# Altium project 6inch_mipi_V1.0.PrjPcb
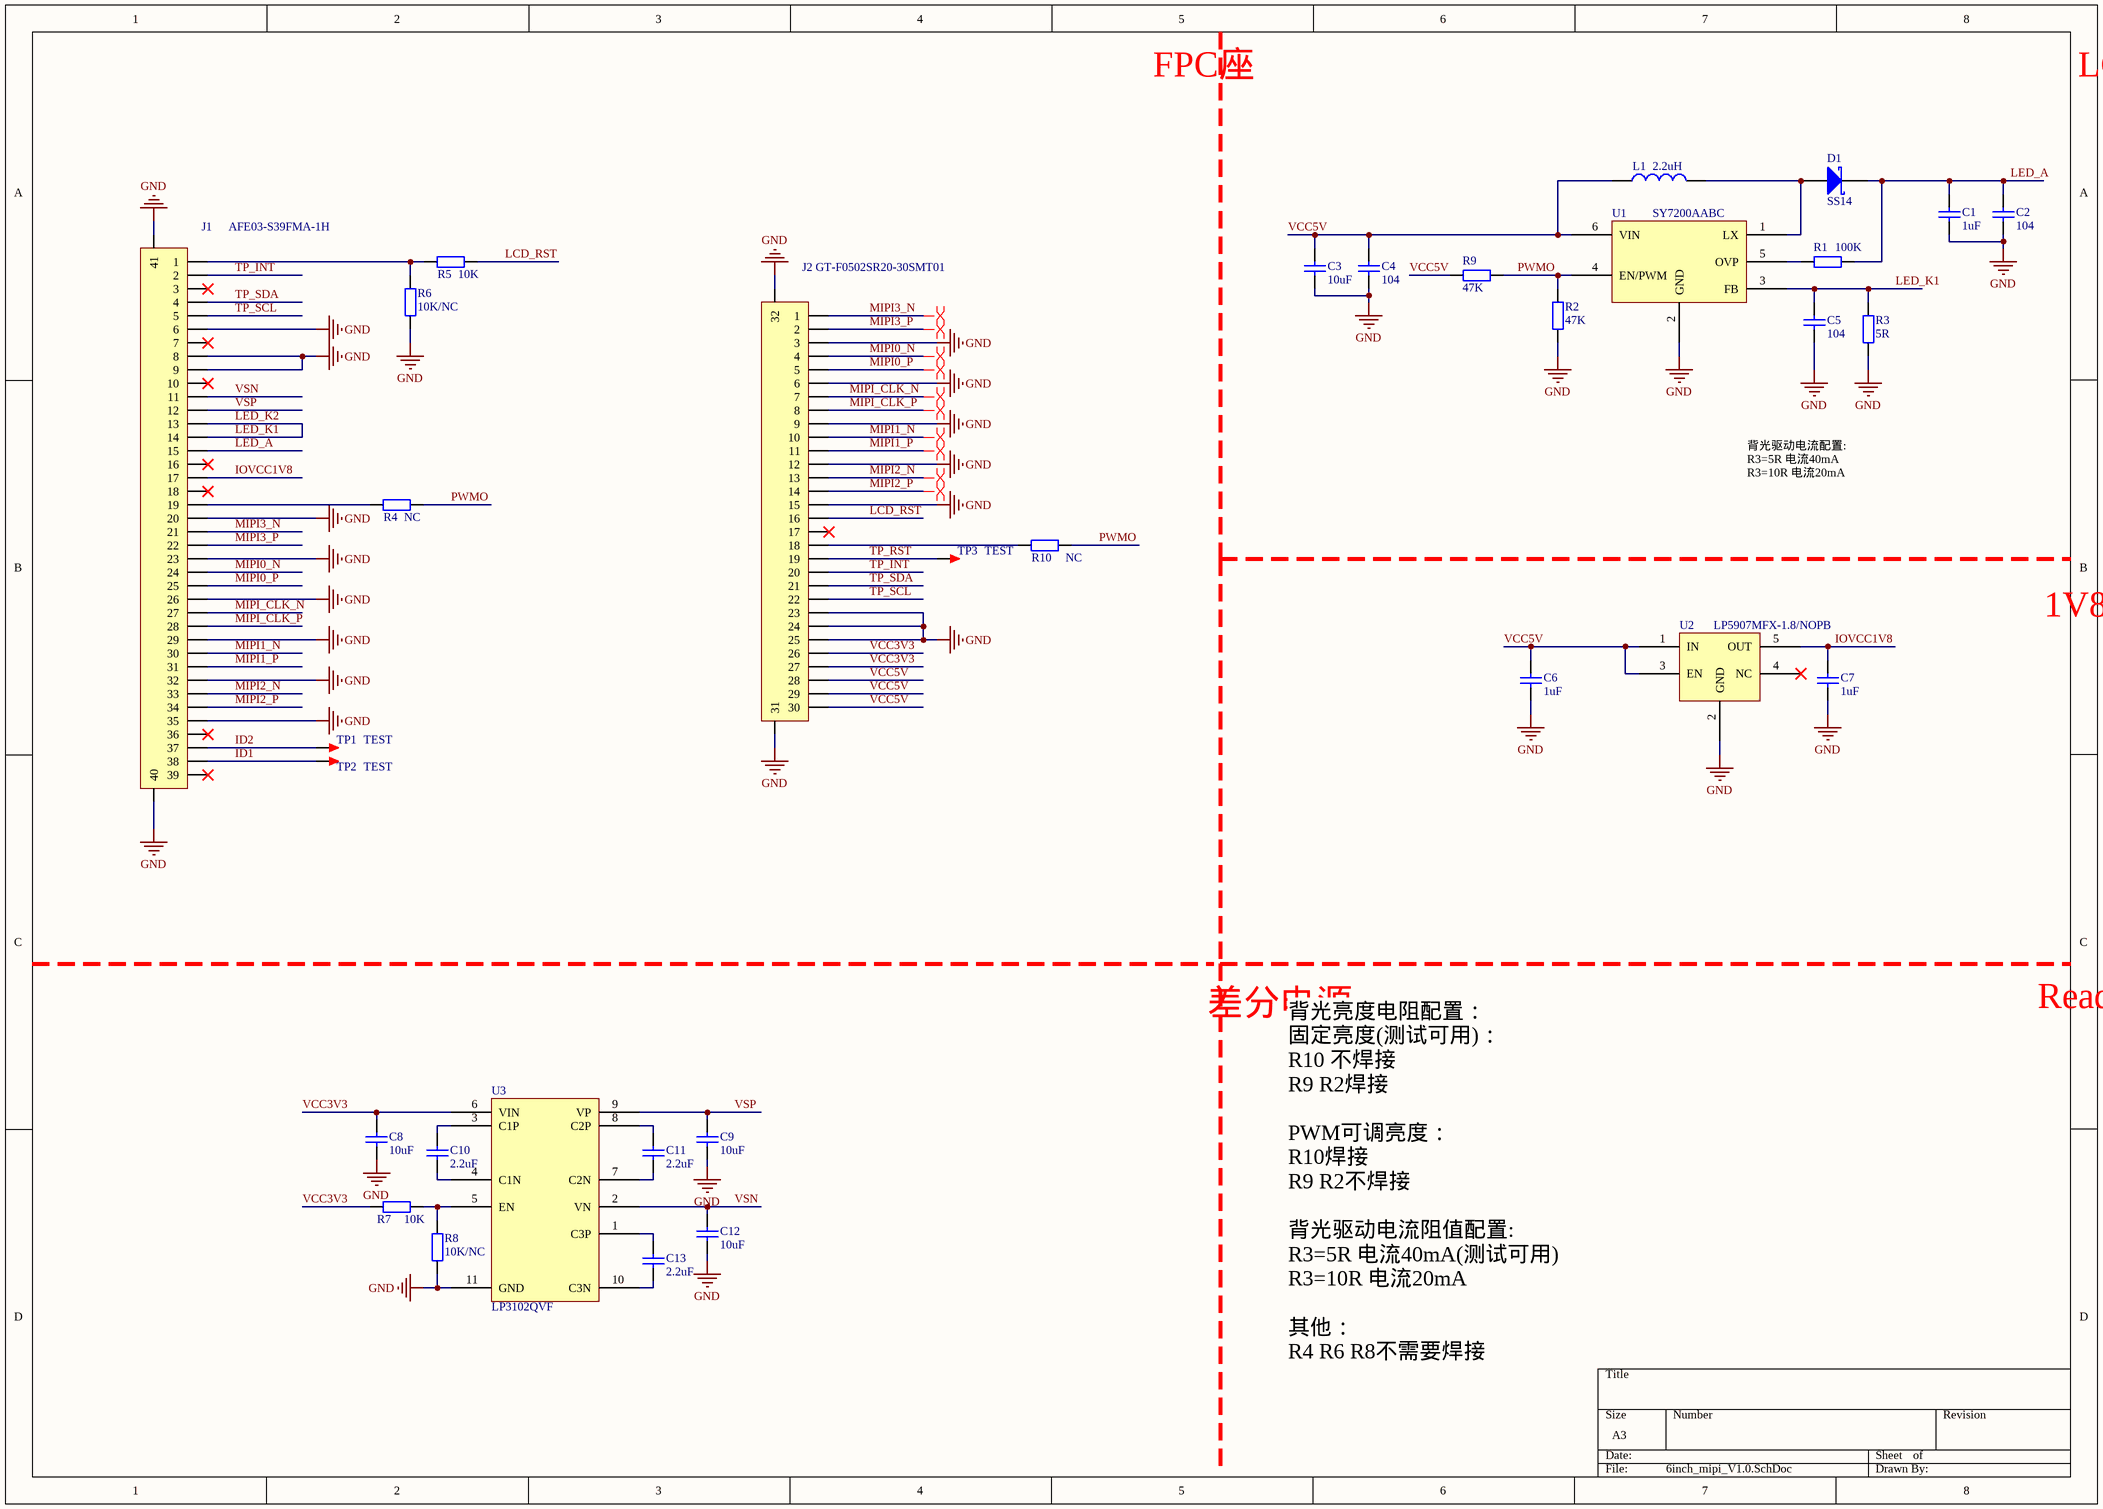
[diagram p0: 6inch_mipi_V1.0.SchDoc]
1 sheet, 33 parts. Net scope: global (net labels, ports and power ports of the same name join across sheets).
Board file: 6inch_mipi_V1.0.PcbDoc

## Sheet 6inch_mipi_V1.0.SchDoc
size A3; SheetNumber: 1; SheetTotal: 1

### Parts
C1  1uF  [C0402_L]
C2  104  [C0402_L]
C3  10uF  [C0402_L]
C4  104  [C0402_L]
C5  104  [C0402_L]
C6  1uF  [C0402_L]
C7  1uF  [C0402_L]
C8  10uF  [C0402_L]
C9  10uF  [C0402_L]
C10  2.2uF  [C0402_L]
C11  2.2uF  [C0402_L]
C12  10uF  [C0402_L]
C13  2.2uF  [C0402_L]
D1  SS14  [SOD-123F]
J1  AFE03-S39FMA-1H  [FPC-SMD_P0.30-39P_FGS-XJ-H1.0]
J2  GT-F0502SR20-30SMT01  [FPC-SMD_30P-P0.50_GT-F0502SR20-30SMT01]
L1  2.2uH  [L-SMD-0420]
R1  100K  [R0402_L]
R2  47K  [R0402_L]
R3  5R  [R0402_L]
R4  NC  [R0402_L]
R5  10K  [R0402_L]
R6  10K/NC  [R0402_L]
R7  10K  [R0402_L]
R8  10K/NC  [R0402_L]
R9  47K  [R0402_L]
R10  NC  [R0402_L]
TP1  TEST  [TEST 1.6]
TP2  TEST  [TEST 1.6]
TP3  TEST  [TEST 1.6]
U1  SY7200AABC  [SOT23-6]
U2  LP5907MFX-1.8/NOPB  [SOT23-5]
U3  LP3102QVF  [TDFN-10_L3.0-W3.0-P0.50-BL-EP]

### Nets
GND: C1.1 C2.1 C3.1 C4.1 C5.1 C6.1 C7.1 C8.1 C9.1 C12.1 J1.6 J1.8 J1.9 J1.20 J1.23 J1.26 J1.29 J1.32 J1.35 J1.40 J1.41 J2.3 J2.6 J2.9 J2.12 J2.15 J2.23 J2.24 J2.25 J2.31 J2.32 R2.2 R3.1 R6.2 R8.2 U1.2(GND) U2.2(GND) U3.11(GND)
ID1: J1.38 TP2.1
ID2: J1.37 TP1.1
IOVCC1V8: C7.2 J1.17 U2.5(OUT)
LCD_RST: J2.16 R5.1
LED_A: C1.2 C2.2 D1.2(K) J1.15 R1.2
LED_K1: C5.2 J1.13 J1.14 R3.2 U1.3(FB)  [also labelled LED_K2]
MIPI0_N: J1.24 J2.4
MIPI0_P: J1.25 J2.5
MIPI1_N: J1.30 J2.10
MIPI1_P: J1.31 J2.11
MIPI2_N: J1.33 J2.13
MIPI2_P: J1.34 J2.14
MIPI3_N: J1.21 J2.1
MIPI3_P: J1.22 J2.2
MIPI_CLK_N: J1.27 J2.7
MIPI_CLK_P: J1.28 J2.8
PWMO: R2.1 R4.1 R9.2 R10.1 U1.4(EN/PWM)
TP_INT: J1.2 J2.20
TP_RST: J2.19 TP3.1
TP_SCL: J1.5 J2.22
TP_SDA: J1.4 J2.21
VCC3V3: C8.2 J2.26 J2.27 R7.1 U3.6(VIN)
VCC5V: C3.2 C4.2 C6.2 J2.28 J2.29 J2.30 L1.1 R9.1 U1.6(VIN) U2.1(IN) U2.3(EN)
VSN: C12.2 J1.11 U3.2(VN)
VSP: C9.2 J1.12 U3.9(VP)
NetC10_1: C10.1 U3.4(C1N)
NetC10_2: C10.2 U3.3(C1P)
NetC11_1: C11.1 U3.7(C2N)
NetC11_2: C11.2 U3.8(C2P)
NetC13_1: C13.1 U3.10(C3N)
NetC13_2: C13.2 U3.1(C3P)
NetD1_1: D1.1(A) L1.2 U1.1(LX)
NetJ1_1: J1.1 R5.2 R6.1
NetJ1_19: J1.19 R4.2
NetJ2_18: J2.18 R10.2
NetR1_1: R1.1 U1.5(OVP)
NetR7_2: R7.2 R8.1 U3.5(EN)

Not connected (* = marked no-connect by the designer): J1 3* 7* 10* 16* 18* 36* 39*; J2 17*; U2 4(NC)*

### Layout directives
differential pair: MIPI0_N, MIPI0_P, MIPI1_N, MIPI1_P, MIPI2_N, MIPI2_P, MIPI3_N, MIPI3_P, MIPI_CLK_N, MIPI_CLK_P

### Notes on the sheet
- FPC座
- LCD背光驱动电路
- 背光驱动电流配置:
  R3=5R 电流40mA
  R3=10R 电流20mA
- 1V8 LDO
- 差分电源
- Readme
- 背光亮度电阻配置：
  固定亮度(测试可用)：
  R10 不焊接
  R9 R2焊接
  PWM可调亮度：
  R10焊接
  R9 R2不焊接
  背光驱动电流阻值配置:
  R3=5R 电流40mA(测试可用)
  R3=10R 电流20mA
  其他：
  R4 R6 R8不需要焊接

### Library data of the parts
C1-C13 = C: 贴片电容/MLCC电容; BOM名称: 无极性贴片电容; 联系卖家，免费查找封装: 唯一出售店铺网址https://shop463601444.taobao.com
D1 = SS14: 肖特基二极管; 属性: 40V/1A; 以赠品形式获赠本封装库的买家，还可联系卖家免费指导AD软件使用: 封装库来自淘宝卖家ID：黄晶宝石; BOM名称: 肖特基二极管
J1 = AFE03-S39FMA-1H: FPC座下接 0.3mm 39P
J2 = GT-F0502SR20-30SMT01: FPC座下接 0.5mm 30P
L1 = L: 贴片小功率电感; BOM名称: 小功率贴片电感; 联系卖家，免费查找封装: 唯一出售店铺网址https://shop463601444.taobao.com
R1-R10 = R: 贴片电阻; 联系卖家，免费查找封装: 唯一出售店铺网址https://shop463601444.taobao.com; BOM名称: 贴片电阻
TP1-TP3 = TEST: 测试点; 联系卖家，免费查找封装: 唯一出售店铺网址https://shop463601444.taobao.com; 封装库来自淘宝卖家ID：黄晶宝石: 其他店铺购入的，请立即申请退款，本店现金奖励20~500元; BOM名称: 测试点
U1 = SY7200AABC: 30V 2A LED驱动芯片
U2 = LP5907MFX-1.8/NOPB: 1.8V LDO芯片
U3 = LP3102QVF: 双路电荷泵DC/DC